# Altium schematic sheet Keyboard.SchDoc: Smart Bus Ticketing Machine/Keyboard
size A4; Date: 3/10/2025; ApprovedBy: Kiran Gunathilaka; CheckedBy: Kiran Gunathilaka; Author: Kiran Gunathilaka; DrawnBy: Kiran Gunathilaka; DocumentNumber: 06; Revision: v1.0; SheetNumber: 5; SheetTotal: 11
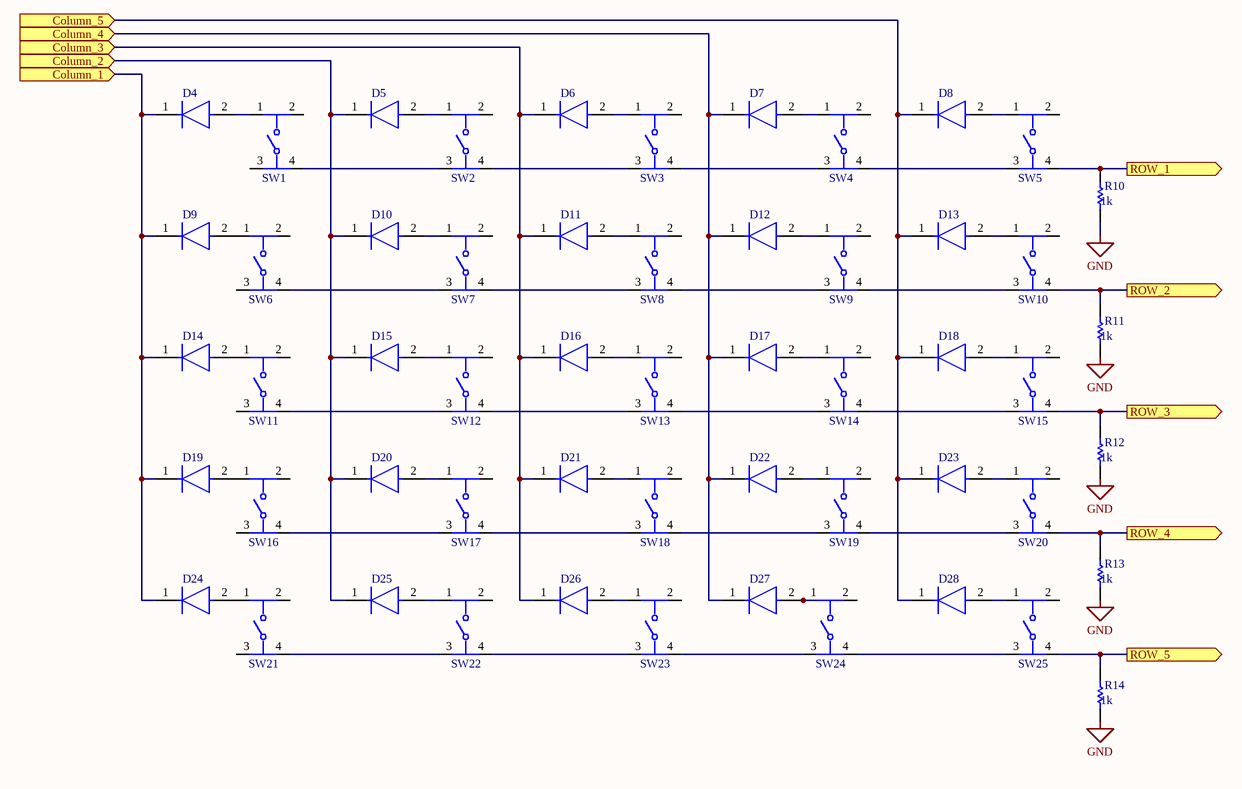
[diagram p0: Keyboard.SchDoc]

## Parts
D4  TS4148 RYG  [FP-TS4148_RYG-MFG]  (value not drawn)
D5  TS4148 RYG  [FP-TS4148_RYG-MFG]  (value not drawn)
D6  TS4148 RYG  [FP-TS4148_RYG-MFG]  (value not drawn)
D7  TS4148 RYG  [FP-TS4148_RYG-MFG]  (value not drawn)
D8  TS4148 RYG  [FP-TS4148_RYG-MFG]  (value not drawn)
D9  TS4148 RYG  [FP-TS4148_RYG-MFG]  (value not drawn)
D10  TS4148 RYG  [FP-TS4148_RYG-MFG]  (value not drawn)
D11  TS4148 RYG  [FP-TS4148_RYG-MFG]  (value not drawn)
D12  TS4148 RYG  [FP-TS4148_RYG-MFG]  (value not drawn)
D13  TS4148 RYG  [FP-TS4148_RYG-MFG]  (value not drawn)
D14  TS4148 RYG  [FP-TS4148_RYG-MFG]  (value not drawn)
D15  TS4148 RYG  [FP-TS4148_RYG-MFG]  (value not drawn)
D16  TS4148 RYG  [FP-TS4148_RYG-MFG]  (value not drawn)
D17  TS4148 RYG  [FP-TS4148_RYG-MFG]  (value not drawn)
D18  TS4148 RYG  [FP-TS4148_RYG-MFG]  (value not drawn)
D19  TS4148 RYG  [FP-TS4148_RYG-MFG]  (value not drawn)
D20  TS4148 RYG  [FP-TS4148_RYG-MFG]  (value not drawn)
D21  TS4148 RYG  [FP-TS4148_RYG-MFG]  (value not drawn)
D22  TS4148 RYG  [FP-TS4148_RYG-MFG]  (value not drawn)
D23  TS4148 RYG  [FP-TS4148_RYG-MFG]  (value not drawn)
D24  TS4148 RYG  [FP-TS4148_RYG-MFG]  (value not drawn)
D25  TS4148 RYG  [FP-TS4148_RYG-MFG]  (value not drawn)
D26  TS4148 RYG  [FP-TS4148_RYG-MFG]  (value not drawn)
D27  TS4148 RYG  [FP-TS4148_RYG-MFG]  (value not drawn)
D28  TS4148 RYG  [FP-TS4148_RYG-MFG]  (value not drawn)
R10  Resistance: 1k  [RESC2013X60X35ML10T20]  (hidden comment: RC0805FR-071KL)
R11  Resistance: 1k  [RESC2013X60X35ML10T20]  (hidden comment: RC0805FR-071KL)
R12  Resistance: 1k  [RESC2013X60X35ML10T20]  (hidden comment: RC0805FR-071KL)
R13  Resistance: 1k  [RESC2013X60X35ML10T20]  (hidden comment: RC0805FR-071KL)
R14  Resistance: 1k  [RESC2013X60X35ML10T20]  (hidden comment: RC0805FR-071KL)
SW1  PTS645SM43SMTR92LFS  [FP-PTS645SM43SMTR92LFS-MFG]  (value not drawn)
SW2  PTS645SM43SMTR92LFS  [FP-PTS645SM43SMTR92LFS-MFG]  (value not drawn)
SW3  PTS645SM43SMTR92LFS  [FP-PTS645SM43SMTR92LFS-MFG]  (value not drawn)
SW4  PTS645SM43SMTR92LFS  [FP-PTS645SM43SMTR92LFS-MFG]  (value not drawn)
SW5  PTS645SM43SMTR92LFS  [FP-PTS645SM43SMTR92LFS-MFG]  (value not drawn)
SW6  PTS645SM43SMTR92LFS  [FP-PTS645SM43SMTR92LFS-MFG]  (value not drawn)
SW7  PTS645SM43SMTR92LFS  [FP-PTS645SM43SMTR92LFS-MFG]  (value not drawn)
SW8  PTS645SM43SMTR92LFS  [FP-PTS645SM43SMTR92LFS-MFG]  (value not drawn)
SW9  PTS645SM43SMTR92LFS  [FP-PTS645SM43SMTR92LFS-MFG]  (value not drawn)
SW10  PTS645SM43SMTR92LFS  [FP-PTS645SM43SMTR92LFS-MFG]  (value not drawn)
SW11  PTS645SM43SMTR92LFS  [FP-PTS645SM43SMTR92LFS-MFG]  (value not drawn)
SW12  PTS645SM43SMTR92LFS  [FP-PTS645SM43SMTR92LFS-MFG]  (value not drawn)
SW13  PTS645SM43SMTR92LFS  [FP-PTS645SM43SMTR92LFS-MFG]  (value not drawn)
SW14  PTS645SM43SMTR92LFS  [FP-PTS645SM43SMTR92LFS-MFG]  (value not drawn)
SW15  PTS645SM43SMTR92LFS  [FP-PTS645SM43SMTR92LFS-MFG]  (value not drawn)
SW16  PTS645SM43SMTR92LFS  [FP-PTS645SM43SMTR92LFS-MFG]  (value not drawn)
SW17  PTS645SM43SMTR92LFS  [FP-PTS645SM43SMTR92LFS-MFG]  (value not drawn)
SW18  PTS645SM43SMTR92LFS  [FP-PTS645SM43SMTR92LFS-MFG]  (value not drawn)
SW19  PTS645SM43SMTR92LFS  [FP-PTS645SM43SMTR92LFS-MFG]  (value not drawn)
SW20  PTS645SM43SMTR92LFS  [FP-PTS645SM43SMTR92LFS-MFG]  (value not drawn)
SW21  PTS645SM43SMTR92LFS  [FP-PTS645SM43SMTR92LFS-MFG]  (value not drawn)
SW22  PTS645SM43SMTR92LFS  [FP-PTS645SM43SMTR92LFS-MFG]  (value not drawn)
SW23  PTS645SM43SMTR92LFS  [FP-PTS645SM43SMTR92LFS-MFG]  (value not drawn)
SW24  PTS645SM43SMTR92LFS  [FP-PTS645SM43SMTR92LFS-MFG]  (value not drawn)
SW25  PTS645SM43SMTR92LFS  [FP-PTS645SM43SMTR92LFS-MFG]  (value not drawn)

## Ports
Column_1 (in, see Main[2D], MCU[3B]), Column_2 (in, see Main[2D], MCU[3B]), Column_3 (in, see Main[2D], MCU[3B]), Column_4 (in, see Main[2D], MCU[3B]), Column_5 (in, see Main[2D], MCU[3B]), ROW_1 (out, see Main[2D], MCU[1A]), ROW_2 (out, see Main[2D], MCU[1A]), ROW_3 (out, see Main[2D], MCU[1A]), ROW_4 (out, see Main[2D], MCU[1A]), ROW_5 (out, see Main[2D], MCU[1A])

## Nets
GND: R10.1 R11.1 R12.1 R13.1 R14.1
Column_1: D4.1(C) D9.1(C) D14.1(C) D19.1(C) D24.1(C) ; port Column_1
Column_2: D5.1(C) D10.1(C) D15.1(C) D20.1(C) D25.1(C) ; port Column_2
Column_3: D6.1(C) D11.1(C) D16.1(C) D21.1(C) D26.1(C) ; port Column_3
Column_4: D7.1(C) D12.1(C) D17.1(C) D22.1(C) D27.1(C) ; port Column_4
Column_5: D8.1(C) D13.1(C) D18.1(C) D23.1(C) D28.1(C) ; port Column_5
ROW_1: R10.2 SW5.4 ; port ROW_1
ROW_2: R11.2 SW10.4 ; port ROW_2
ROW_3: R12.2 SW15.4 ; port ROW_3
ROW_4: R13.2 SW20.4 ; port ROW_4
ROW_5: R14.2 SW25.4 ; port ROW_5
NetD4_2: D4.2(A) SW1.1
NetD5_2: D5.2(A) SW2.1
NetD6_2: D6.2(A) SW3.1
NetD7_2: D7.2(A) SW4.1
NetD8_2: D8.2(A) SW5.1
NetD9_2: D9.2(A) SW6.1
NetD10_2: D10.2(A) SW7.1
NetD11_2: D11.2(A) SW8.1
NetD12_2: D12.2(A) SW9.1
NetD13_2: D13.2(A) SW10.1
NetD14_2: D14.2(A) SW11.1
NetD15_2: D15.2(A) SW12.1
NetD16_2: D16.2(A) SW13.1
NetD17_2: D17.2(A) SW14.1
NetD18_2: D18.2(A) SW15.1
NetD19_2: D19.2(A) SW16.1
NetD20_2: D20.2(A) SW17.1
NetD21_2: D21.2(A) SW18.1
NetD22_2: D22.2(A) SW19.1
NetD23_2: D23.2(A) SW20.1
NetD24_2: D24.2(A) SW21.1
NetD25_2: D25.2(A) SW22.1
NetD26_2: D26.2(A) SW23.1
NetD27_2: D27.2(A) SW24.1
NetD28_2: D28.2(A) SW25.1
NetSW1_4: SW1.4 SW2.3
NetSW2_4: SW2.4 SW3.3
NetSW3_4: SW3.4 SW4.3
NetSW4_4: SW4.4 SW5.3
NetSW6_4: SW6.4 SW7.3
NetSW7_4: SW7.4 SW8.3
NetSW8_4: SW8.4 SW9.3
NetSW9_4: SW9.4 SW10.3
NetSW11_4: SW11.4 SW12.3
NetSW12_4: SW12.4 SW13.3
NetSW13_4: SW13.4 SW14.3
NetSW14_4: SW14.4 SW15.3
NetSW16_4: SW16.4 SW17.3
NetSW17_4: SW17.4 SW18.3
NetSW18_4: SW18.4 SW19.3
NetSW19_4: SW19.4 SW20.3
NetSW21_4: SW21.4 SW22.3
NetSW22_4: SW22.4 SW23.3
NetSW23_4: SW23.4 SW24.3
NetSW24_4: SW24.4 SW25.3

Not connected (* = marked no-connect by the designer): SW1 2 3; SW2 2; SW3 2; SW4 2; SW5 2; SW6 2 3; SW7 2; SW8 2; SW9 2; SW10 2; SW11 2 3; SW12 2; SW13 2; SW14 2; SW15 2; SW16 2 3; SW17 2; SW18 2; SW19 2; SW20 2; SW21 2 3; SW22 2; SW23 2; SW24 2; SW25 2

## Library data of the parts
D4-D28 = CMP-15605-000006-1: Rectifier Diode Switching 75V 0.15A 4ns 2-Pin Case 0805(2012Metric) T/R; Peak Non-Repetitive Surge Current: 2A; Element Configuration: Single; Forward Voltage: 1V; Max Operating Temperature: 175°C; Packaging: Tape and Reel; Radiation Hardening: No; Min Operating Temperature: -65°C; Reverse Recovery Time: 4ns; Mount: Surface Mount; RoHS Compliant: Yes; Max Forward Surge Current (Ifsm): 2A; Case/Package: SMD/SMT; Number of Pins: 2; Max Repetitive Reverse Voltage (Vrrm): 75V
R10-R14 = CMP-2100-03671-1: Chip Resistor, 1 KOhm, +/- 1%, 125 mW, -55 to 155 degC, 0805 (2012 Metric), RoHS, Tape and Reel; Manufacturer: Yageo; Temperature Coefficient: 100ppm/degreesC; Voltage Rating (DC): 150V; Max Power Dissipation: 125mW; Number of Pins: 2; Number of Terminations: 2; Datasheet URL: http://www.yageo.com/NewPortal/yageodocoutput?fileName=/pdf/R-Chip/PYu-RC_Group_51_RoHS_L_5.pdf; Length: 0.079inch; Package Description: 2-Pin Surface Mounted Device, Body 2 x 1.25 mm; Depth: 1.25mm; Height: 0.024inch; Military Standard: Not; Case/Package: 0805; Package Reference: 0805; RoHSCompliant: true; Lead Free: LeadFree; Packaging: TapeandReel; Package Quantity: 1; Datasheet Version: Rev. 5, 10/2016; Tolerance: 1%; Min Operating Temperature: -55degC; Voltage Rating: 150V; Composition: ThickFilm; Case Code (Imperial): 0805; Power Rating: 125mW; Width: 0.049inch; Case Code (Metric): 2012; Manufacturer URL: http://www.yageo.com/; Max Operating Temperature: 155degC; REACH SVHC: Unknown; Termination: SMD/SMT
SW1-SW25 = CMP-2000-05160-2: SWITCH TACTILE SPST-NO 0.05A 12V; Contact Resistance: 100mR; Throw Configuration: SPST; Illumination Type: Non-Illuminated; Mechanical Life: 100000Cycles; Current Rating: 50mA; Switch Function: Off-Mom; Actuator Length: 0.85mm; Actuator Material: Nylon; Actuator Type: Standard; Operating Force: 160gf; Min Operating Temperature: -20°C; REACH SVHC: No SVHC; Termination: Gull Wing; Case/Package: SMD/SMT; Packaging: Tape and Reel; Mount: Surface Mount; Voltage Rating (DC): 12V; Orientation: Straight; Lead Free: Lead Free; Contact Material: Silver; Color: Black; Max Current Rating: 50mA; Contact Plating: Silver; Depth: 9mm; Package Quantity: 1; Max Voltage Rating (DC): 12V; Length: 6mm; Max Operating Temperature: 60°C